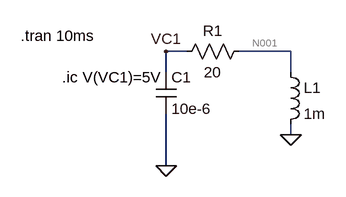
[diagram p0: schematic RLC1.asc]
RLC1.asc, the LTspice schematic file:
Version 4
SHEET 1 880 680
WIRE 64 128 32 128
WIRE 224 128 144 128
WIRE 32 160 32 128
WIRE 224 160 224 128
WIRE 224 256 224 240
WIRE 32 304 32 224
FLAG 224 256 0
FLAG 32 128 VC1
FLAG 32 304 0
SYMBOL res 48 144 R270
WINDOW 0 32 56 VTop 2
WINDOW 3 0 56 VBottom 2
SYMATTR InstName R1
SYMATTR Value 20
SYMBOL ind 208 144 R0
SYMATTR InstName L1
SYMATTR Value 1m
SYMBOL cap 16 160 R0
SYMATTR InstName C1
SYMATTR Value 10e-6
TEXT -192 104 Left 2 !.tran 10ms
TEXT -128 168 Left 2 !.ic V(VC1)=5V

The netlist it stands for:
* RLC1.asc
R1 VC1 N001 20
L1 N001 0 1m
C1 VC1 0 10e-6
.tran 10ms
.ic V(VC1)=5V
.backanno
.end

* Results of the author's LTspice run, read from the files saved beside the schematic
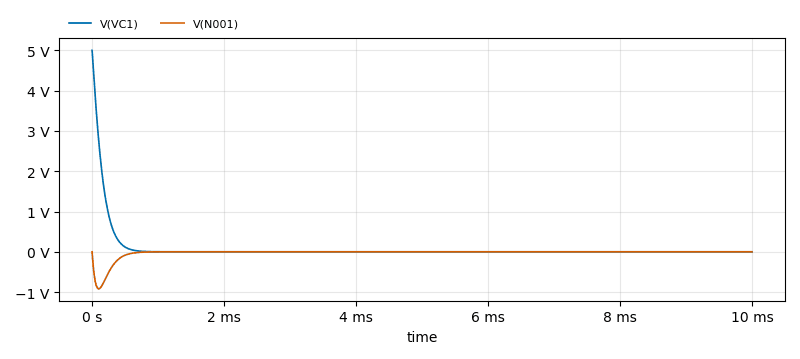
[diagram p1: Transient Analysis of RLC1.asc, plotted from the saved traces]
* Transient Analysis, 1 run:
*   V(VC1): min 0 V, max 5 V, average 75.08 mV, rms 451.3 mV, last 0 V
*   V(N001): min -918.6 mV, max 250 µV, average -24.94 mV, rms 124.8 mV, last 0 V